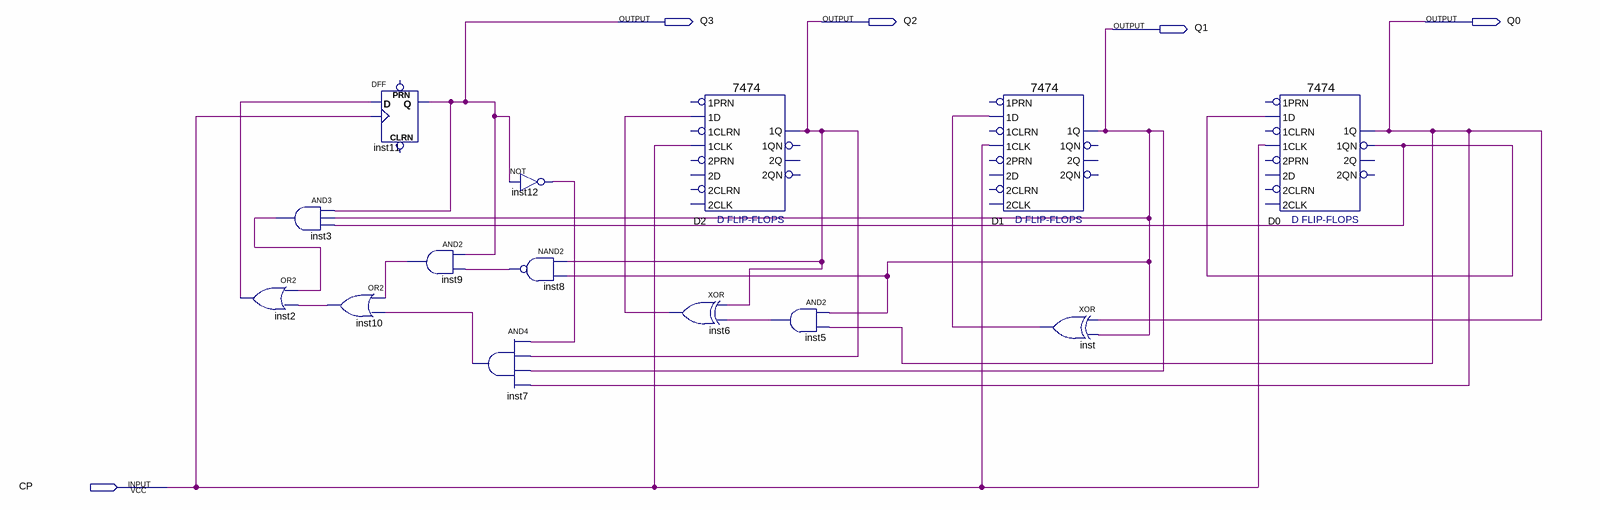
[diagram p0: schematic sheet]
// Quartus schematic fourBitCounterAsync.bdf as structural Verilog: 14 symbols, 5 pins
module fourBitCounterAsync (
  input  CP,
  output Q3,
  output Q2,
  output Q0,
  output Q1
);

  wire D0_1qn, inst2_out, inst3_out, inst5_out, inst6_out, inst7_out, inst8_out, inst9_out, inst10_out,
       inst12_out, inst_out;

  or inst2 (inst2_out, inst3_out, inst10_out);
  and inst3 (inst3_out, Q3, Q1, D0_1qn);
  DFF inst11 (.CLK(CP), .D(inst2_out), .Q(Q3));  // open: CLRN, PRN
  or inst10 (inst10_out, inst9_out, inst7_out);
  and inst9 (inst9_out, Q3, inst8_out);
  and inst7 (inst7_out, inst12_out, Q2, Q1, Q0);
  not inst12 (inst12_out, Q3);
  nand inst8 (inst8_out, Q2, Q1);
  xor inst6 (inst6_out, Q2, inst5_out);
  \7474  D2 (.\1CLK (CP), .\1D (inst6_out), .\1Q (Q2));  // open: 2D, 2PRN, 1PRN, 2CLK, 2CLRN, 1CLRN, 1QN, 2Q, 2QN
  and inst5 (inst5_out, Q1, Q0);
  \7474  D1 (.\1CLK (CP), .\1D (inst_out), .\1Q (Q1));  // open: 2D, 2PRN, 1PRN, 2CLK, 2CLRN, 1CLRN, 1QN, 2Q, 2QN
  xor inst (inst_out, Q0, Q1);
  \7474  D0 (
    .\1CLK (CP), .\1D (D0_1qn), .\1QN (D0_1qn), .\1Q (Q0));  // open: 2D, 2PRN, 1PRN, 2CLK, 2CLRN, 1CLRN, 2Q, 2QN
endmodule
